# Altium schematic sheet 音频滤波.SchDoc
size A4
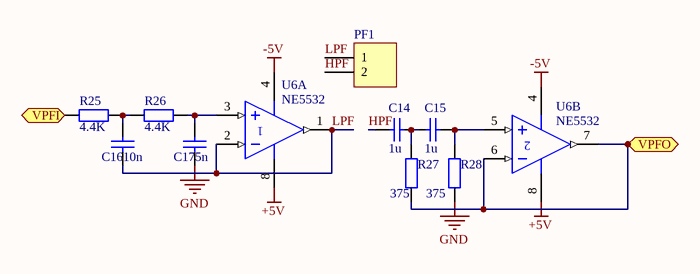
[diagram p0: 音频滤波.SchDoc]

## Parts
C14  瓷片电容  [瓷片电容]  (value not drawn)
C15  瓷片电容  [瓷片电容]  (value not drawn)
C16  瓷片电容  [瓷片电容]  (value not drawn)
C17  瓷片电容  [瓷片电容]  (value not drawn)
PF1  Header 2  [HDR1X2]  (value not drawn)
R25  value 4.4K  [AXIAL-0.4]  (hidden comment: Res2)
R26  value 4.4K  [AXIAL-0.4]  (hidden comment: Res2)
R27  value 375  [AXIAL-0.4]  (hidden comment: Res2)
R28  value 375  [AXIAL-0.4]  (hidden comment: Res2)
U6  NE5532  [JG008]  (parts A,B of 2)

## Ports
VPFI (in), VPFO (out)

## Nets
+5V: U6.8(V+)
-5V: U6.4(V-)
GND: C17.1 R28.1
HPF: C14.2 PF1.2
LPF: C16.1 PF1.1 U6.1(OUT) U6.2(IN-)
VPFI: R25.2 ; port VPFI
VPFO: R27.1 U6.6(IN-) U6.7(OUT) ; port VPFO
NetC14_1: C14.1 C15.2 R27.2
NetC15_1: C15.1 R28.2 U6.5(IN+)
NetC16_2: C16.2 R25.1 R26.2
NetC17_2: C17.2 R26.1 U6.3(IN+)

## Notes on the sheet
- 标题
- 日期
- 红外数字模拟接收一体机
- 2015 5 29
- 作者
- 模电组
- 单位
- 电子技术协会
- (in symbol 瓷片电容) 10n; 5n; 1u

## Library data of the parts
PF1 = Header 2: Header, 2-Pin; LatestRevisionDate: 17-Jul-2002; LatestRevisionNote: Re-released for DXP Platform.; Publisher: Altium Limited
R25-R28 = Res2: Resistor; Published: 8-Jun-2000; LatestRevisionDate: 17-Jul-2002; LatestRevisionNote: Re-released for DXP Platform.; PackageReference: AXIAL-0.4; Publisher: Altium Limited
U6 = NE5532AJG: Dual Low-Noise Operational Amplifier; Published: 15-Apr-2002; LatestRevisionDate: 04-Mar-2005; LatestRevisionNote: Stylized 3D Model Added.; DatasheetVersion: May-1988; PackageVersion: Jan-1995; PackageReference: JG008; Publisher: Altium Limited; PackageDescription: DIP; 8 Leads; Row Spacing 7.62 mm; Pitch 2.54 mm; ComponentLink1Description: Manufacturer Link; ComponentLink1URL: http://www.ti.com/; ComponentLink2Description: Datasheet; ComponentLink2URL: http://www-s.ti.com/sc/ds/ne5532a.pdf